# EAGLE design bt_board (EAGLE 9.3.0)
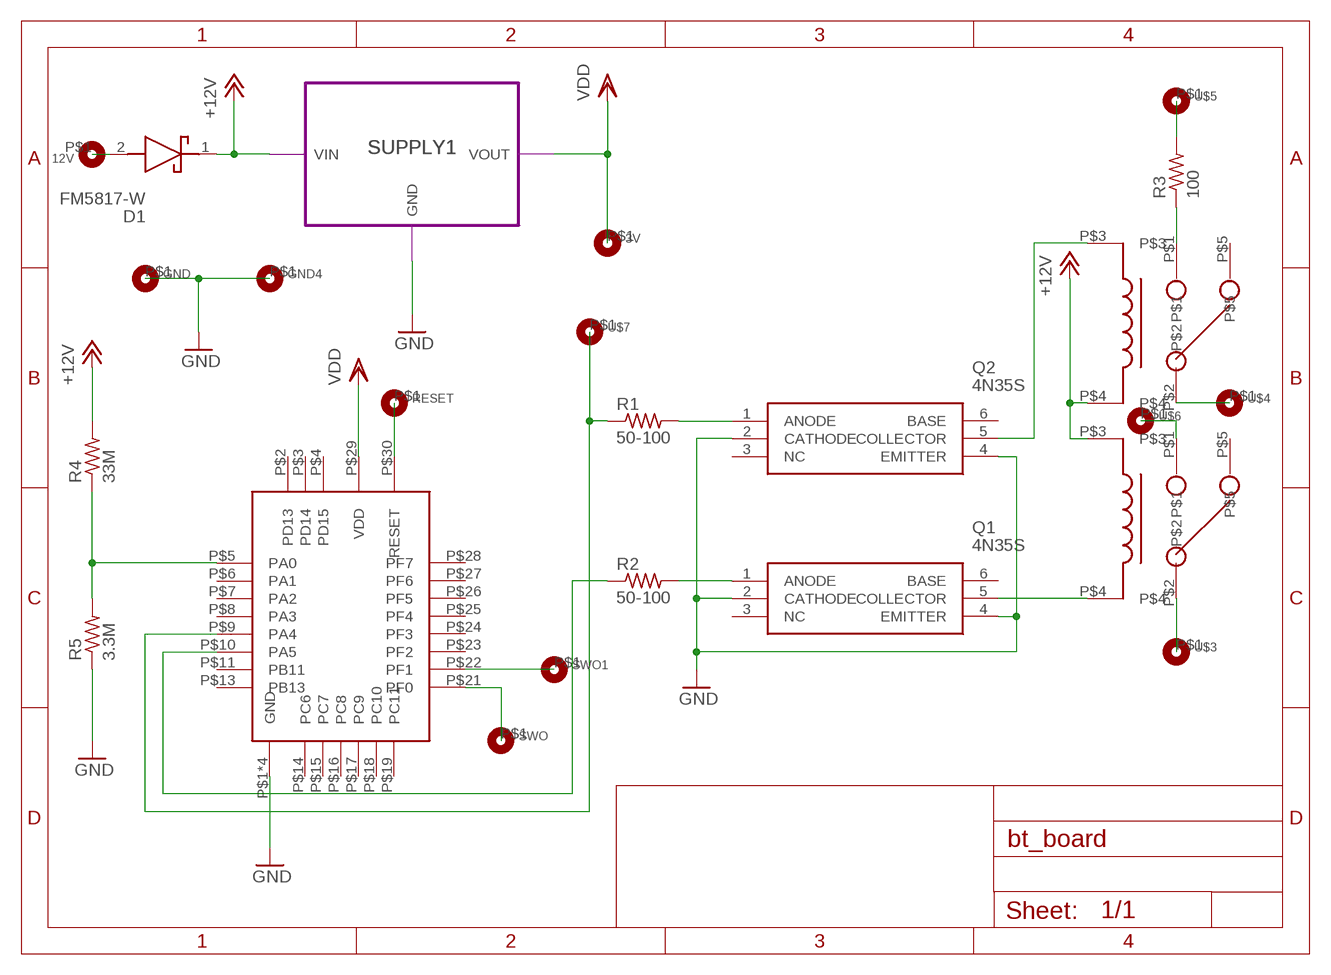
[diagram p0: schematic, sheet 1]

## Parts
3V  GND  TEST_PAD  [TEST_PAD]
12V  12V  HOLE_2MM  [HOLE_2MM]
BGM111  BGM111  [BGM111]
D1  FM5817-W  [DIOM5025X231N]
GND  GND  HOLE_2MM  [HOLE_2MM]
GND4  GND  TEST_PAD  [TEST_PAD]
Q1  4N35S  [SOT254P916X508-6N]
Q2  4N35S  [SOT254P916X508-6N]
R1  50-100  R-US_M0805  [M0805]
R2  50-100  R-US_M0805  [M0805]
R3  100  R-US_M0805  [M0805]
R4  33M  R-US_R0603  [R0603]
R5  3.3M  R-US_R0603  [R0603]
RESET  GND  TEST_PAD  [TEST_PAD]
SWO  GND  TEST_PAD  [TEST_PAD]
SWO1  GND  TEST_PAD  [TEST_PAD]
U$1  103-1CH-C-12VDC  [103-1CH-C-12VDC]
U$2  103-1CH-C-12VDC  [103-1CH-C-12VDC]
U$3  HOLE_2MM  [HOLE_2MM]
U$4  HOLE_2MM  [HOLE_2MM]
U$5  HOLE_2MM  [HOLE_2MM]
U$6  HOLE_2MM  [HOLE_2MM]
U$7  HOLE_1.5MM  [HOLE_1.5MM]

## Module instances
SUPPLY1 = SUPPLY

## Nets
+12V: D1.1(K) R4.2 U$1.P$3 U$2.P$4 ; port SUPPLY1.VIN
GND: BGM111.P$1(GND) BGM111.P$12(GND) BGM111.P$20(GND) BGM111.P$31(GND) GND4.P$1( ) GND.P$1( ) Q1.2(CATHODE) Q1.4(EMITTER) Q2.2(CATHODE) Q2.4(EMITTER) R5.1 ; port SUPPLY1.GND
N$1: BGM111.P$5(PA0) R4.1 R5.2
N$2: BGM111.P$22(PF1) SWO1.P$1( )
N$3: BGM111.P$21(PF0) SWO.P$1( )
N$4: Q2.1(ANODE) R1.2
N$5: Q1.1(ANODE) R2.2
N$6: BGM111.P$30(RESET) RESET.P$1( )
N$7: Q1.5(COLLECTOR) U$1.P$4
N$8: BGM111.P$9(PA4) R1.1 U$7.P$1( )
N$9: BGM111.P$10(PA5) R2.1
N$10: U$1.P$2 U$3.P$1( )
N$11: U$1.P$1 U$6.P$1( )
N$12: U$2.P$2 U$4.P$1( )
N$13: Q2.5(COLLECTOR) U$2.P$3
N$14: R3.2 U$5.P$1( )
N$15: R3.1 U$2.P$1
N$16: 12V.P$1( ) D1.2(A)
VDD: 3V.P$1( ) BGM111.P$29(VDD) ; port SUPPLY1.VOUT
Unconnected: BGM111.P$2(PD13) BGM111.P$3(PD14) BGM111.P$4(PD15) BGM111.P$6(PA1) BGM111.P$7(PA2) BGM111.P$8(PA3) BGM111.P$11(PB11) BGM111.P$13(PB13) BGM111.P$14(PC6) BGM111.P$15(PC7) BGM111.P$16(PC8) BGM111.P$17(PC9) BGM111.P$18(PC10) BGM111.P$19(PC11) BGM111.P$23(PF2) BGM111.P$24(PF3) BGM111.P$25(PF4) BGM111.P$26(PF5) BGM111.P$27(PF6) BGM111.P$28(PF7) Q1.3(NC) Q1.6(BASE) Q2.3(NC) Q2.6(BASE) U$1.P$5 U$2.P$5

## Library data of the parts
3V GND4 RESET SWO SWO1 = custom:TEST_PAD
12V GND U$3-U$6 = custom:HOLE_2MM
BGM111 = custom:BGM111
D1 = samacsys:FM5817-W: Schottky Diodes & Rectifiers Vr/20V Io/1A T/R Source: Datasheet <https://mouser.componentsearchengine.com/Datasheets/1/FM5817-W.pdf>; DESCRIPTION: Schottky Diodes & Rectifiers Vr/20V Io/1A T/R; HEIGHT: 2.31mm; MANUFACTURER_NAME: Rectron; MANUFACTURER_PART_NUMBER: FM5817-W; MOUSER_PART_NUMBER: 583-FM5817; MOUSER_PRICE-STOCK: https://www.mouser.com/Search/Refine.aspx?Keyword=583-FM5817
Q1 Q2 = samacsys:4N35S: Transistor Output Optocouplers SO-6 PHOTO TRANS Source: Datasheet <http://www.mouser.com/datasheet/2/308/Fairchild Semiconductor_4n25-28_35-37_h11a1-a5-1190949.pdf>; DESCRIPTION: Transistor Output Optocouplers SO-6 PHOTO TRANS; HEIGHT: 5.08mm; MANUFACTURER_NAME: Fairchild Semiconductor; MANUFACTURER_PART_NUMBER: 4N35S; MOUSER_PART_NUMBER: 512-4N35S; MOUSER_PRICE-STOCK: https://www.mouser.com/Search/Refine.aspx?Keyword=512-4N35S
R1-R5 = resistor:R-US_: RESISTOR, American symbol
U$1 U$2 = custom:103-1CH-C-12VDC
U$7 = custom:HOLE_1.5MM

## Module SUPPLY
Ports: GND(io) VIN(io) VOUT(io)
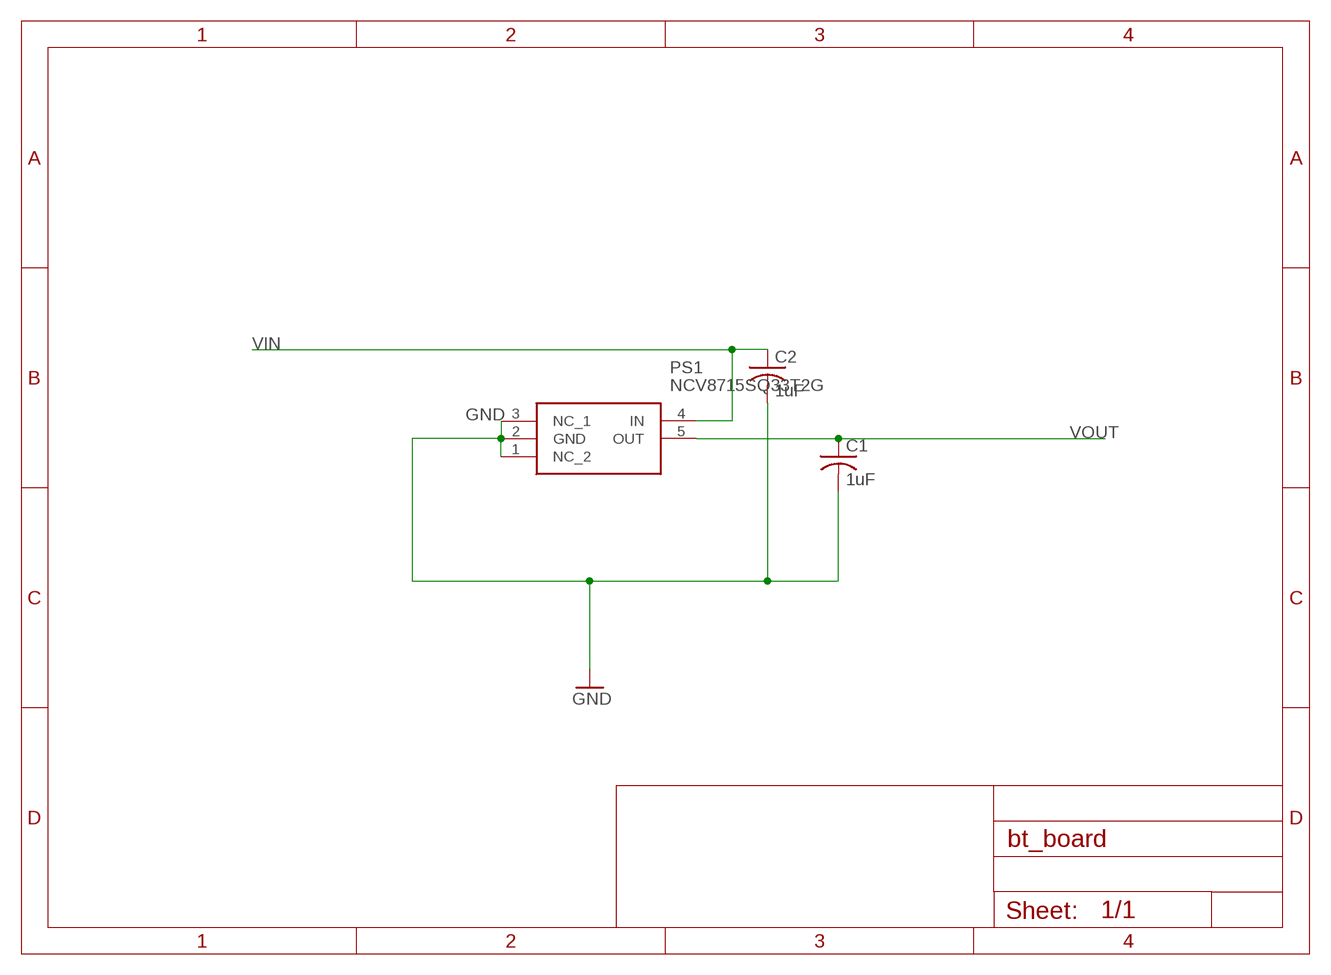
[diagram p1: schematic, module SUPPLY, sheet 1]

### Parts
C1  1uF  C-USC0805  [C0805]
C2  1uF  C-USC0805  [C0805]
PS1  NCV8715SQ33T2G  [SOT65P210X110-5N]

### Nets
GND: C1.2 C2.2 PS1.1(NC_2) PS1.2(GND) PS1.3(NC_1)
VIN: C2.1 PS1.4(IN)
VOUT: C1.1 PS1.5(OUT)

### Library data of the parts
C1 C2 = rcl:C-US: CAPACITOR, American symbol; SPICEPREFIX: C
PS1 = NCV8715SQ33T2G:NCV8715SQ33T2G: LDO Regulator Pos 3.3V 0.2A Automotive 5-Pin SC-88A T/R Source: Datasheet <https://www.arrow.com/en/products/ncv8715sq33t2g/on-semiconductor>; DESCRIPTION: LDO Regulator Pos 3.3V 0.2A Automotive 5-Pin SC-88A T/R; HEIGHT: 1.1mm; MANUFACTURER_NAME: ON Semiconductor; MANUFACTURER_PART_NUMBER: NCV8715SQ33T2G

## Board
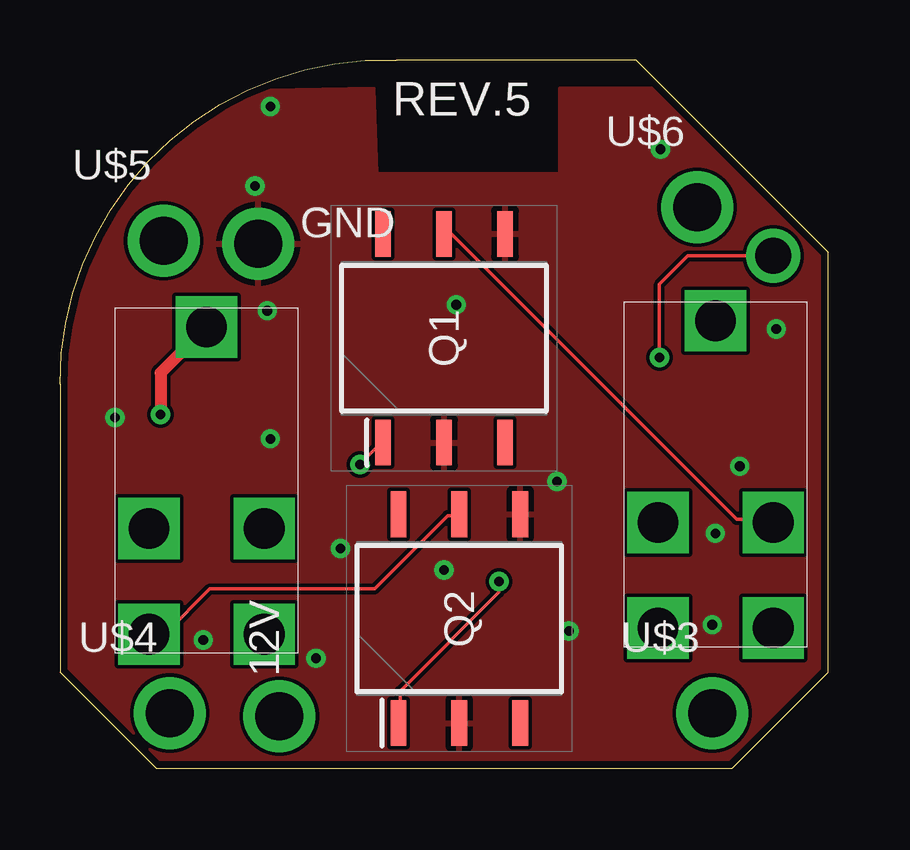
[diagram p2: board, top side]
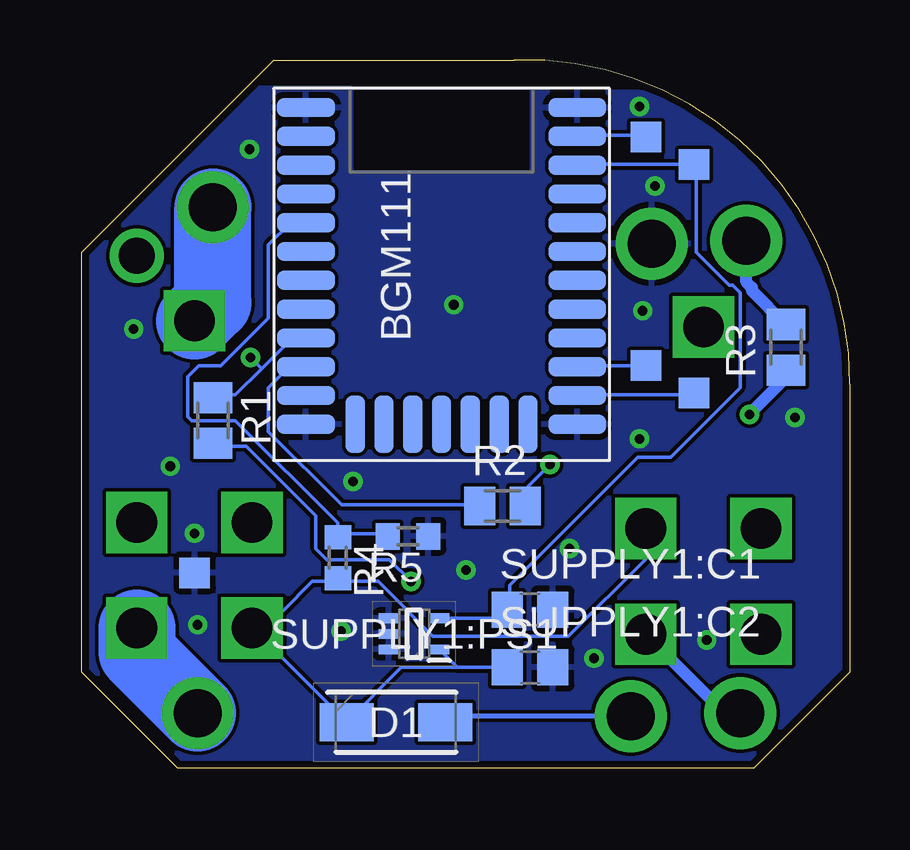
[diagram p3: board, bottom side, seen from below]

Size 32 x 29.5 mm. Coordinates in mm from the lower left corner, seen from the top.
Outline: 4,0 28,0 32,4 32,21.5 24,29.5 14,29.5 arc92 0,16 0,4 4,0
Copper layers (1*16): Top 0.035mm / dielectric 1.5mm / Bottom 0.035mm
Design rules "default *": minimum track width 6mil, minimum drill 0.4mm, track to track 6mil, track to pad 6mil, pad to pad 6mil, via to via 6mil, smd to smd 6mil, copper to edge 0.3mm, drill to drill 6mil, minimum pad ring 10mil, minimum via ring 8mil, stop-mask expansion 4mil, vias tented up to drill 0mil, thermal gap 10mil

### Footprints (pad centres in the part's own frame; a part is rotated, then mirrored left to right if it is on the bottom)
TEST_PAD = smd 1.27 x 1.27: P$1 0,0
HOLE_2MM = drill 2: P$1 0,0
BGM111 = smd 2.4 x 0.8: P$1 -5.65,7.2; P$2 -5.65,6; P$3 -5.65,4.8; P$4 -5.65,3.6; P$5 -5.65,2.4; P$6 -5.65,1.2; P$7 -5.65,0; P$8 -5.65,-1.2; P$9 -5.65,-2.4; P$10 -5.65,-3.6; P$11 -5.65,-4.8; P$12 -5.65,-6; P$20 5.65,-6; P$21 5.65,-4.8; P$22 5.65,-3.6; P$23 5.65,-2.4; P$24 5.65,-1.2; P$25 5.65,0; P$26 5.65,1.2; P$27 5.65,2.4; P$28 5.65,3.6; P$29 5.65,4.8; P$30 5.65,6; P$31 5.65,7.2 | smd 0.8 x 2.4: P$13 -3.6,-6; P$14 -2.4,-6; P$15 -1.2,-6; P$16 0,-6; P$17 1.2,-6; P$18 2.4,-6; P$19 3.6,-6
DIOM5025X231N = smd 2.25 x 1.6: 1 -2.05,0; 2 2.05,0
SOT254P916X508-6N = smd 1.9 x 0.65: 1 -4.35,2.54; 2 -4.35,0; 3 -4.35,-2.54; 4 4.35,-2.54; 5 4.35,0; 6 4.35,2.54
M0805 = smd 1.3 x 1.6: 1 -0.95,0; 2 0.95,0
R0603 = smd 1 x 1.1: 1 -0.85,0; 2 0.85,0
C0805 = smd 1.3 x 1.5: 1 -0.95,0; 2 0.95,0
SOT65P210X110-5N = smd 0.85 x 0.4: 1 1.05,-0.65; 2 1.05,0; 3 1.05,0.65; 4 -1.05,0.65; 5 -1.05,-0.65
103-1CH-C-12VDC = drill 1.7 pad 2.4 square: P$1 3.8,0.8; P$2 1.4,13.6; P$3 6.2,13.6 | drill 1.7 pad 2 square: P$4 1.4,9.2; P$5 6.2,9.2
HOLE_1.5MM = drill 1.5: P$1 0,0

### Placement (x,y rotation side)
3V  6.5,25.15 0 bottom
12V  9.14,2.16 0 top
BGM111  17.02,20.32 0 bottom
D1  18.92,1.91 0 bottom
GND  8.26,21.84 180 top
GND4  27.3,8.13 0 bottom
Q1  16,17.91 90 top
Q2  16.64,6.22 90 top
R1  26.54,14.48 270 bottom
R2  14.48,10.92 0 bottom
R3  2.67,17.53 90 bottom
R4  21.34,8.76 270 bottom
R5  18.41,9.65 180 bottom
RESET  8.5,26.29 0 bottom
SUPPLY1:C1  1uF  [C0805]  13.34,6.6 0 bottom
SUPPLY1:C2  1uF  [C0805]  13.34,4.19 0 bottom
SUPPLY1:PS1  NCV8715SQ33T2G  [SOT65P210X110-5N]  18.16,5.59 180 bottom
SWO  6.5,15.62 0 bottom
SWO1  8.5,16.76 0 bottom
U$1  31.11,19.43 180 top
U$2  9.91,19.18 180 top
U$3  27.18,2.29 0 top
U$4  4.57,2.29 0 top
U$5  4.32,21.97 0 top
U$6  26.54,23.37 0 top
U$7  29.72,21.34 0 top

### Tracks (layer width: path | path; a pad name or v marks a point on that pad's centre or on a via)
+12V
  Bottom 0.152: 21.34,7.77 22.4,7.77 23.62,6.55 24.79,5.9 U$1.P$3 | 21.34,7.77 19.66,7.77 17.37,5.49 11.73,5.49 8.53,8.69 8.53,9.91 U$2.P$4 | 21.34,7.77 R4.2 | SUPPLY1:PS1.4 16.36,4.19 | 16.36,4.19 SUPPLY1:C2.1 | 24.79,5.72 D1.1 18.69,4.19 16.36,4.19
  Bottom 0.508: 24.79,5.72 24.79,5.9
GND  (via drill 0.4)
  other vias: 27.18,5.97 16.51,19.3 2.29,14.61 5.97,5.33 29.84,18.29 8.76,13.72 20.7,11.94 11.68,9.14 10.67,4.57 16,8.26 21.21,5.71 28.32,12.57 25.02,25.78 8.76,27.56 27.3,9.78 8.13,24.26 8.64,19.05
  pour Top: 0,28.07 13.08,28.32 13.21,24.77 20.83,24.77 20.83,28.32 32.26,28.32 32.13,-0.51 -0.13,-0.51
  pour Bottom: 0,3.94 3.94,0 28.07,0 32.13,4.06 32.13,21.34 25.02,28.32 20.83,28.32 20.83,24.77 13.21,24.77 13.21,28.19 -0.13,28.07
N$1
  Bottom 0.152: 21.34,9.75 19.36,9.75 R5.2 | 21.34,9.75 21.34,10.21 25.6,14.48 27.43,14.48 27.58,14.63 27.58,16.31 27.13,16.76 26.21,16.76 24.23,18.75 24.23,21.79 23.32,22.71 22.71,22.71 BGM111.P$5 | 21.34,9.75 R4.1
N$2
  Bottom 0.152: SWO1.P$1 11.28,16.76 BGM111.P$22
N$3
  Bottom 0.152: SWO.P$1 6.55,15.54 11.28,15.54 BGM111.P$21
N$4  (via drill 0.4)
  Top 0.152: v18.29,7.77 18.29,7.32 14.17,3.2 14.17,1.98 Q2.1
  Bottom 0.152: v18.29,7.77 19.2,8.69 21.79,8.69 22.25,9.14 22.25,10.52 25.15,13.41 26.52,13.41 R1.2
N$5  (via drill 0.4)
  Top 0.152: v12.5,12.65 13.41,13.56 Q1.1
  Bottom 0.152: v12.5,12.65 13.41,11.73 13.41,10.97 R2.2
N$6
  Bottom 0.152: RESET.P$1 8.53,26.36 11.28,26.36 BGM111.P$30
N$7
  Top 0.152: Q1.5 16.31,22.25 28.19,10.36 29.57,10.36 U$1.P$4
N$8  (via drill 0.4)
  Top 0.152: v24.98,17.11 24.98,20.15 26.16,21.34 U$7.P$1
  Bottom 0.152: 23.32,17.83 22.71,17.83 22.71,17.88 BGM111.P$9 23.32,17.83 | 23.32,17.83 24.51,16.64 | 24.51,16.64 25.6,15.54 26.52,15.54 R1.1 | 24.51,16.64 v24.98,17.11
N$9
  Bottom 0.152: R2.1 15.54,10.97 21.18,10.97 24.23,14.02 24.23,15.85 23.47,16.61 22.71,16.61 BGM111.P$10
N$10
  Bottom 3.2: U$1.P$2 29.71,4.82 U$3.P$1
N$11
  Bottom 3.2: U$1.P$1 26.54,19.4 U$6.P$1
N$12
  Bottom 0.508: U$2.P$2 5.21,2.29 U$4.P$1
N$13
  Top 0.152: Q2.5 16.61,10.52 16.15,10.52 13.11,7.47 6.25,7.47 4.42,5.64 3.81,5.64 U$2.P$3
N$14
  Bottom 0.508: R3.2 4.09,19.9 4.09,20.01 4.32,20.24 U$5.P$1
N$15  (via drill 0.4)
  Top 0.508: U$2.P$1 4.19,16.46 v4.19,14.73
  Bottom 0.508: v4.19,14.73 2.67,16.26 R3.1
N$16
  Bottom 0.2: 12V.P$1 16.62,2.16
  Bottom 0.508: 16.62,2.16 D1.2
VDD
  Bottom 0.152: BGM111.P$29 11.28,25.15 3V.P$1 6.4,25.05 6.4,21.49 5.03,20.12 4.88,20.12 4.57,19.81 4.57,15.85 7.47,12.95 8.84,12.95 14.17,7.62 14.17,6.72 SUPPLY1:C1.1 14.65,6.24 SUPPLY1:PS1.5

### Text on the board
tNames: REV.5